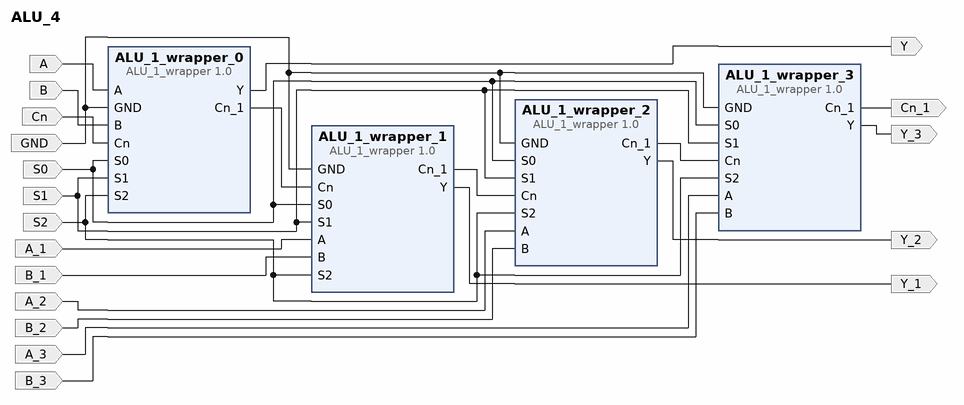
[diagram p0: block diagram of the top level]
# Vivado block design ALU_4, Vivado 2015.3
create_bd_design ALU_4

create_bd_port -dir I A
create_bd_port -dir I B
create_bd_port -dir I Cn
create_bd_port -dir I GND
create_bd_port -dir I S0
create_bd_port -dir I S1
create_bd_port -dir I S2
create_bd_port -dir I A_1
create_bd_port -dir I B_1
create_bd_port -dir I A_2
create_bd_port -dir I B_2
create_bd_port -dir I A_3
create_bd_port -dir I B_3
create_bd_port -dir O Y
create_bd_port -dir O Y_1
create_bd_port -dir O Y_2
create_bd_port -dir O Cn_1
create_bd_port -dir O Y_3

create_bd_cell -type ip -vlnv Sirius:user:ALU_1_wrapper:1.0 ALU_1_wrapper_0
create_bd_cell -type ip -vlnv Sirius:user:ALU_1_wrapper:1.0 ALU_1_wrapper_1
create_bd_cell -type ip -vlnv Sirius:user:ALU_1_wrapper:1.0 ALU_1_wrapper_2
create_bd_cell -type ip -vlnv Sirius:user:ALU_1_wrapper:1.0 ALU_1_wrapper_3

# ---- connections ----

connect_bd_net [get_bd_pins ALU_1_wrapper_0/Cn_1] [get_bd_pins ALU_1_wrapper_1/Cn]
connect_bd_net [get_bd_pins ALU_1_wrapper_1/Cn_1] [get_bd_pins ALU_1_wrapper_2/Cn]
connect_bd_net [get_bd_pins ALU_1_wrapper_2/Cn_1] [get_bd_pins ALU_1_wrapper_3/Cn]
connect_bd_net [get_bd_ports A] [get_bd_pins ALU_1_wrapper_0/A]
connect_bd_net [get_bd_ports B] [get_bd_pins ALU_1_wrapper_0/B]
connect_bd_net [get_bd_ports Cn] [get_bd_pins ALU_1_wrapper_0/Cn]
connect_bd_net [get_bd_ports GND] \
  [get_bd_pins ALU_1_wrapper_0/GND] [get_bd_pins ALU_1_wrapper_1/GND] [get_bd_pins ALU_1_wrapper_2/GND] \
  [get_bd_pins ALU_1_wrapper_3/GND]
connect_bd_net -net S0_1 [get_bd_ports S0] \
  [get_bd_pins ALU_1_wrapper_0/S0] [get_bd_pins ALU_1_wrapper_1/S0] [get_bd_pins ALU_1_wrapper_2/S0] \
  [get_bd_pins ALU_1_wrapper_3/S0]
connect_bd_net -net S1_1 [get_bd_ports S1] \
  [get_bd_pins ALU_1_wrapper_0/S1] [get_bd_pins ALU_1_wrapper_1/S1] [get_bd_pins ALU_1_wrapper_2/S1] \
  [get_bd_pins ALU_1_wrapper_3/S1]
connect_bd_net -net S2_1 [get_bd_ports S2] \
  [get_bd_pins ALU_1_wrapper_0/S2] [get_bd_pins ALU_1_wrapper_1/S2] [get_bd_pins ALU_1_wrapper_2/S2] \
  [get_bd_pins ALU_1_wrapper_3/S2]
connect_bd_net -net A_1_1 [get_bd_ports A_1] [get_bd_pins ALU_1_wrapper_1/A]
connect_bd_net -net B_1_1 [get_bd_ports B_1] [get_bd_pins ALU_1_wrapper_1/B]
connect_bd_net -net A_2_1 [get_bd_ports A_2] [get_bd_pins ALU_1_wrapper_2/A]
connect_bd_net -net B_2_1 [get_bd_ports B_2] [get_bd_pins ALU_1_wrapper_2/B]
connect_bd_net -net A_3_1 [get_bd_ports A_3] [get_bd_pins ALU_1_wrapper_3/A]
connect_bd_net -net B_3_1 [get_bd_ports B_3] [get_bd_pins ALU_1_wrapper_3/B]
connect_bd_net [get_bd_pins ALU_1_wrapper_0/Y] [get_bd_ports Y]
connect_bd_net [get_bd_pins ALU_1_wrapper_1/Y] [get_bd_ports Y_1]
connect_bd_net [get_bd_pins ALU_1_wrapper_2/Y] [get_bd_ports Y_2]
connect_bd_net [get_bd_pins ALU_1_wrapper_3/Cn_1] [get_bd_ports Cn_1]
connect_bd_net [get_bd_pins ALU_1_wrapper_3/Y] [get_bd_ports Y_3]

validate_bd_design
save_bd_design
